# Altium schematic sheet 31_Controlador_USB.SchDoc
size A4; SheetNumber: 13; SheetTotal: 28
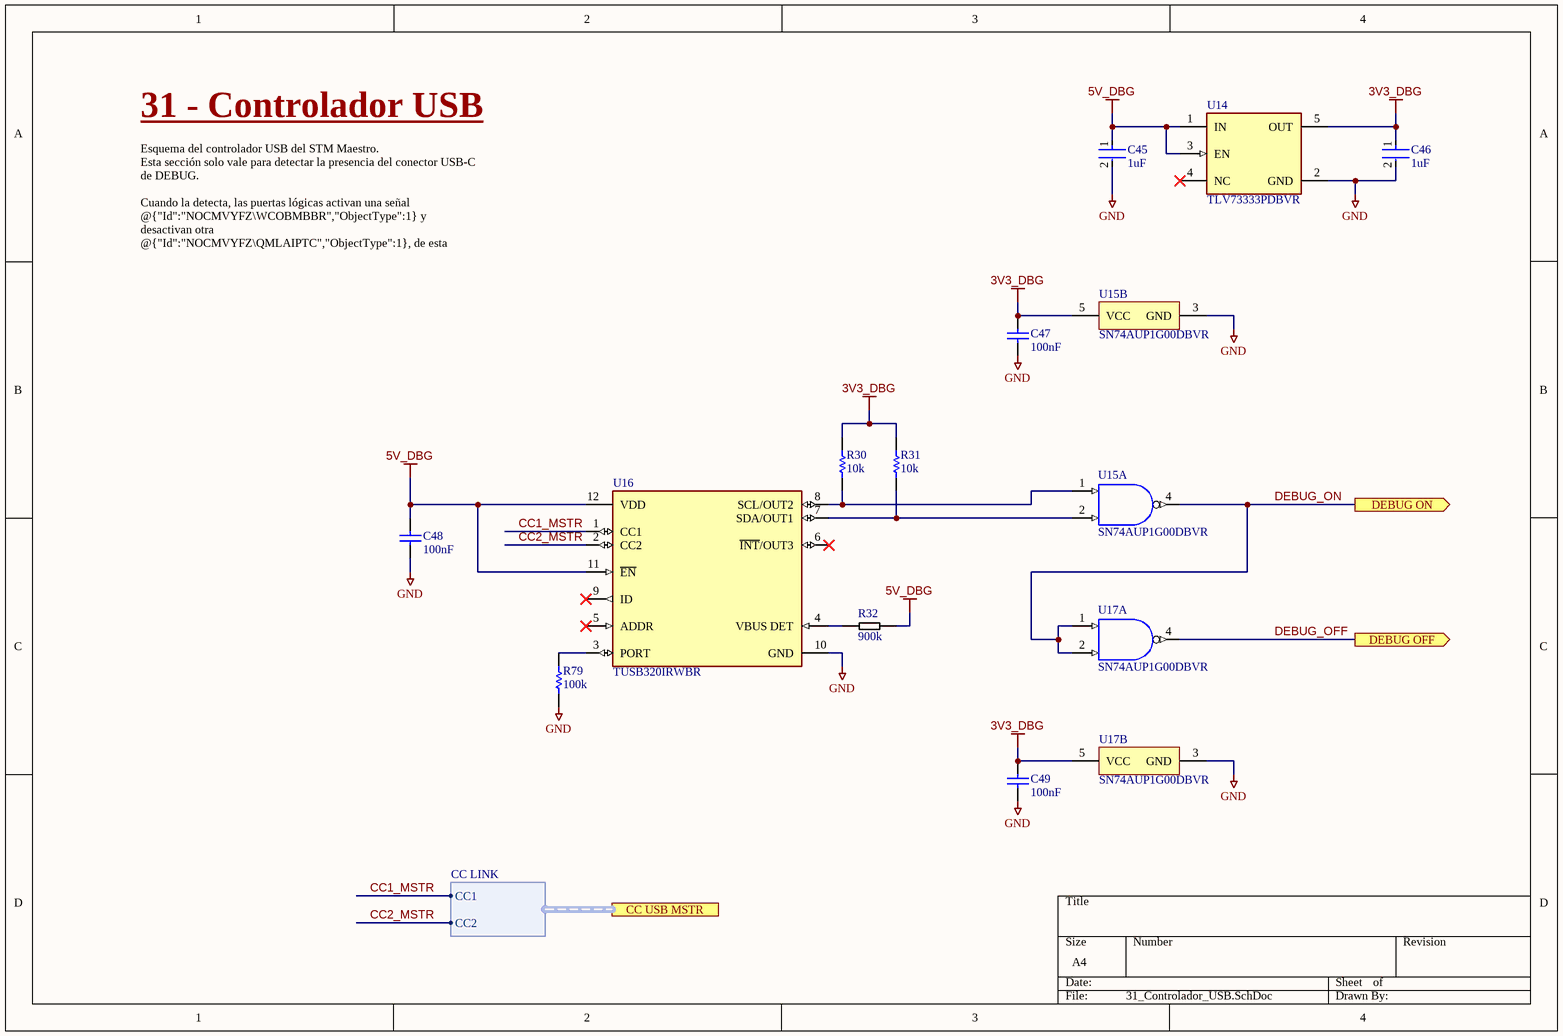
[diagram p0: 31_Controlador_USB.SchDoc]

## Parts
C45  1uF  [FP-C0402C-BB-IPC_B]
C46  1uF  [FP-C0402C-BB-IPC_B]
C47  100nF  [CAPC1005X55X25NL05T05]
C48  100nF  [CAPC1005X55X25NL05T05]
C49  100nF  [CAPC1005X55X25NL05T05]
R30  10k  [RESC1005X40X25NL05T05]
R31  10k  [RESC1005X40X25NL05T05]
R32  900k  [RES 1206]
R79  100k  [RESC1005X40X25ML10T10]
U14  TLV73333PDBVR  [FP-DBV0005A-MFG]
U15  SN74AUP1G00DBVR  [DBV0005A_N]  (parts A,B of 2)
U16  TUSB320IRWBR  [FP-RWB0012A-MFG]
U17  SN74AUP1G00DBVR  [DBV0005A_N]  (parts A,B of 2)

## Ports
CC USB MSTR (harness CC LINK), DEBUG OFF (out), DEBUG ON (out)

## Harnesses
CC LINK: CC1, CC2

## Nets
3V3_DBG: C46.1 C47.2 C49.2 R30.2 R31.2 U14.5(OUT) U15.5(VCC) U17.5(VCC)
5V_DBG: C45.1 C48.2 R32.1 U14.1(IN) U14.3(EN) U16.11(~{EN}) U16.12(VDD)
GND: C45.2 C46.2 C47.1 C48.1 C49.1 R79.1 U14.2(GND) U15.3(GND) U16.10(GND) U17.3(GND)
CC1_MSTR: U16.1(CC1) ; port CC USB MSTR.CC1
CC2_MSTR: U16.2(CC2) ; port CC USB MSTR.CC2
DEBUG_OFF: U17.4(Y) ; port DEBUG OFF
DEBUG_ON: U15.4(Y) U17.1(A) U17.2(B) ; port DEBUG ON
NetR30_1: R30.1 U15.1(A) U16.8(SCL/OUT2)
NetR31_1: R31.1 U15.2(B) U16.7(SDA/OUT1)
NetR32_2: R32.2 U16.4(VBUS_DET)
NetR79_2: R79.2 U16.3(PORT)

Not connected (* = marked no-connect by the designer): U14 4(NC)*; U16 5(ADDR)* 6(~{INT}/OUT3)* 9(ID)*

## Notes on the sheet
- 31 - Controlador USB
- Esquema del controlador USB del STM Maestro.
  Esta sección solo vale para detectar la presencia del conector USB-C de DEBUG.
  Cuando la detecta, las puertas lógicas activan una señal @{"Id":"NOCMVYFZ\WCOBMBBR","ObjectType":1} y desactivan otra @{"Id":"NOCMVYFZ\QMLAIPTC","ObjectType":1}, de esta forma, se puede saber en todo momento si el conector USB está conectado o no.

## Library data of the parts
C45 C46 = CMP-03020-034679-1: CAP CER 1UF 16V X5R 0402; Dielectric Material: Ceramic; Tolerance: 10%; RoHS Compliant: Yes; Voltage Rating (DC): 16V; Voltage Rating: 16V; Max Operating Temperature: 85°C; Packaging: Cut Tape; Width: 0.02inch; Dielectric: X5R; Lead Free: Lead Free; Min Operating Temperature: -55°C; Mount: Surface Mount; Case/Package: 0402; Thickness: 0.022inch; REACH SVHC: No SVHC; Length: 0.039inch; Case Code (Metric): 1005; Case Code (Imperial): 0402; Capacitance: 1uF
C47-C49 = CMP-2008-02030-1: Manufacturer: Vitramon; Part Number: VJ0402Y104KXJCW1BC
R30 R31 = CMP-2002-00601-1: Manufacturer: Panasonic; Part Number: ERJ-2RHD1002X
R32 = RT1206CRE07900KL: 900k Resistor 200V 1206 0.5%; Supplier 1: DigiKey; Supplier Part Number 1: 13-RT1206CRE07900KLCT-ND
R79 = CMP-2002-04583-1: Part Number: SG73P1ETTP1003F; Manufacturer: KOA Speer
U14 = CMP-04917-000053-1: IC REG LINEAR 3.3V 300MA SOT23-5; Manufacturer: Texas Instruments; Max Junction Temp: +125°C; Accuracy Percentage: 1%; Min Supply Voltage: 1.4V; Number Of Outputs: 1; Dropout Voltage: 125mV; Nominal Supply Current: 34uA; Max Supply Voltage: 5.5V; Output Type: Fixed; Standoff Height: 0mm; Digikey Description: IC REG LINEAR 3.3V 300MA SOT23-5; Manufacturer Part Number: TLV73333PDBVR; Temperature Range High: +125°C; Temperature: -40°C to +125°C; Output Current: 300mA; Mouser Description: LDO Voltage Regulators Capacitr-Free 300-mA 5-SOT-23 -40 to 125; Automotive: No; Height: 1.45mm; Device Class L3: Voltage Regulators - Linear; ComponentLink2Description: Datasheet; Device Class L1: Integrated Circuits (ICs); ComponentLink2URL: http://www.ti.com/lit/ds/symlink/tlv733p.pdf; Octopart: https://octopart.com/tlv73333pdbvr-texas+instruments-51080890; Temperature Range Low: -40°C; RoHS: TRUE; Lead Free: Yes; Output Voltage: 3.3V; Package: DBV0005A; Device Class L2: Power Management ICs; Category: IC
U15 U17 = CMP-0859-00110-3: Low-Power Single Two-Input Positive-NAND Gate, DBV0005A, LARGE T&R; Manufacturer: Texas Instruments; ICC @ Nom Voltage(Max)(mA): 0.0009; VCC(Max)(V): 3.6; Rating: Catalog; Schmitt Trigger: No; Voltage(Nom)(V): 0.8,1.2,1.5,1.8,2.5,3.3; Output Drive (IOL/IOH)(Max)(mA): 20/-20; Logic: True; Bits(#): 1; Technology Family: AUP; tpd @ Nom Voltage(Max)(ns): 28.4,21.9,14.7,11.5,8.1,6.5; Output Type: CMOS; Gate Type: NAND; VCC(Min)(V): 0.8; F @ Nom Voltage(Max)(Mhz): 100; PackageReference: DBV0005A; Generic Part Number: SN74AUP1G00; Sub-Family: NAND Gate; DatasheetVersion: SCES604I; 3-State Output: No; Input Type: CMOS; Operating Temperature Range(C): -40 to 85
U16 = CMP-04877-000006-1: IC INTERFACE SPECIALIZED 12X2QFN; Number of Ports: 1; Max Supply Voltage: 5V; USB Standard: USB 1.1; Interface: I2C; Min Supply Voltage: 2.7V; ESD Protection: Yes; Data Rate: 480Mbps; REACH SVHC: No SVHC; Mount: Surface Mount; Min Operating Temperature: -40°C; Case/Package: TQFP; Lead Free: Lead Free; Length: 1.65mm; Contact Plating: Gold; Height: 0.4mm; Max Operating Temperature: 85°C; Number of Pins: 12; Packaging: Tape and Reel; RoHS Compliant: Yes; Width: 1.65mm